# EAGLE design msp430g2553in20-test-board (EAGLE 6.4)
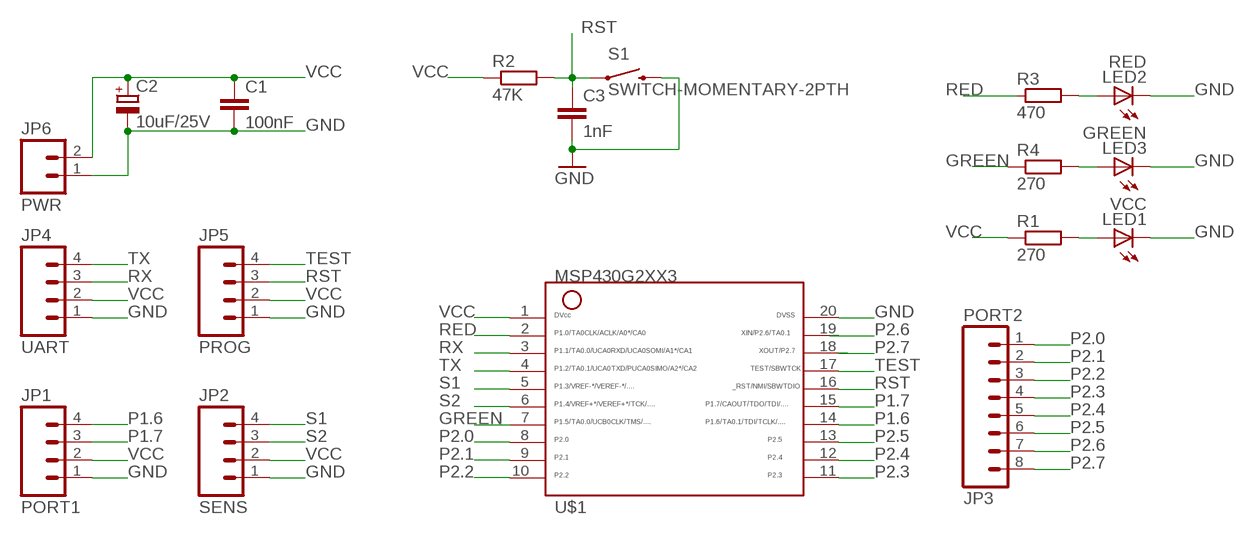
[diagram p0: schematic, sheet 1]

## Parts
C1  100nF  C-EU025-025X050  [C025-025X050]
C2  10uF/25V  CPOL-EUE2-5  [E2-5]
C3  1nF  C-EU025-025X050  [C025-025X050]
JP1  PORT1  M04PTH  [1X04]
JP2  SENS  M04PTH  [1X04]
JP3  PORT2  M081X08  [1X08]
JP4  UART  M04PTH  [1X04]
JP5  PROG  M04PTH  [1X04]
JP6  PWR  M02POLAR  [MOLEX-1X2]
LED1  VCC  LED3MM  [LED3MM]
LED2  RED  LED3MM  [LED3MM]
LED3  GREEN  LED3MM  [LED3MM]
R1  270  R-EU_0204/5  [0204/5]
R2  47K  R-EU_0204/5  [0204/5]
R3  470  R-EU_0204/5  [0204/5]
R4  270  R-EU_0204/5  [0204/5]
S1  SWITCH-MOMENTARY-2PTH  [TACTILE-PTH]
U$1  G2XX3---N20  [N20]

## Nets
GND: C1.2 C2.- C3.2 JP1.1 JP2.1 JP4.1 JP5.1 JP6.1 LED1.K(C) LED2.K(C) LED3.K(C) S1.3 U$1.20
GREEN: R4.1 U$1.7
N$1: LED3.A R4.2
N$4: LED1.A R1.2
N$5: LED2.A R3.2
P1.6: JP1.4 U$1.14
P1.7: JP1.3 U$1.15
P2.0: JP3.1 U$1.8
P2.1: JP3.2 U$1.9
P2.2: JP3.3 U$1.10
P2.3: JP3.4 U$1.11
P2.4: JP3.5 U$1.12
P2.5: JP3.6 U$1.13
P2.6: JP3.7 U$1.19
P2.7: JP3.8 U$1.18
RED: R3.1 U$1.2
RST: C3.1 JP5.3 R2.2 S1.1 U$1.16
RX: JP4.3 U$1.3
S1: JP2.4 U$1.5
S2: JP2.3 U$1.6
TEST: JP5.4 U$1.17
TX: JP4.4 U$1.4
VCC: C1.1 C2.+ JP1.2 JP2.2 JP4.2 JP5.2 JP6.2 R1.1 R2.1 U$1.1

## Library data of the parts
C1 C3 = rcl:C-EU: CAPACITOR, European symbol
C2 = rcl:CPOL-EU: POLARIZED CAPACITOR, European symbol
JP1 JP2 JP4 JP5 = SparkFun-Connectors:M04: Header 4 Standard 4-pin 0.1" header. Use with straight break away headers (SKU : PRT-00116), right angle break away headers (PRT-00553), swiss pins (PRT-00743), machine pins (PRT-00117), and female headers (PRT-00115). Molex polarized connector foot print use with SKU : PRT-08231 with associated crimp pins and housings. 1MM SMD Version SKU: PRT-10208
JP3 = SparkFun-Connectors:M08: Header 8 Standard 8-pin 0.1" header. Use with straight break away headers (SKU : PRT-00116), right angle break away headers (PRT-00553), swiss pins (PRT-00743), machine pins (PRT-00117), and female headers (PRT-00115).
JP6 = SparkFun-Connectors:M02: Header 2 Standard 2-pin 0.1" header. Use with straight break away headers (SKU : PRT-00116), right angle break away headers (PRT-00553), swiss pins (PRT-00743), machine pins (PRT-00117), and female headers (PRT-00115). Molex polarized connector foot print use with SKU : PRT-08233 with associated crimp pins and housings.
LED1-LED3 = led:LED: LED OSRAM: - CHIPLED LG R971, LG N971, LY N971, LG Q971, LY Q971, LO R971, LY R971 LH N974, LH R974 LS Q976, LO Q976, LY Q976 LO Q996 - Hyper CHIPLED LW Q18S LB Q993, LB Q99A, LB R99A - SideLED LS A670, LO A670, LY A670, LG A670, LP A670 LB A673, LV A673, LT A673, LW A673 LH A674 LY A675 LS A676, LA A676, LO A676, LY A676, LW A676 LS A679, LY A679, LG A679 - Hyper Micro SIDELED® LS Y876, LA Y876, LO Y876, LY Y876 LT Y87S - SmartLED LW L88C, LW L88S LB L89C, LB L89S, LG L890 LS L89K, LO L89K, LY L89K LS L896, LA L896, LO L896, LY L896 - TOPLED LS T670, LO T670, LY T670, LG T670, LP T670 LSG T670, LSP T670, LSY T670, LOP T670, LYG T670 LG T671, LOG T671, LSG T671 LB T673, LV T673, LT T673, LW T673 LH T674 LS T676, LA T676, LO T676, LY T676, LB T676, LH T676, LSB T676, LW T676 LB T67C, LV T67C, LT T67C, LS T67K, LO T67K, LY T67K, LW E67C LS E67B, LA E67B, LO E67B, LY E67B, LB E67C, LV E67C, LT E67C LW T67C LS T679, LY T679, LG T679 LS T770, LO T770, LY T770, LG T770, LP T770 LB T773, LV T773, LT T773, LW T773 LH T774 LS E675, LA E675, LY E675, LS T675 LS T776, LA T776, LO T776, LY T776, LB T776 LHGB T686 LT T68C, LB T68C - Hyper Mini TOPLED® LB M676 - Mini TOPLED Santana® LG M470 LS M47K, LO M47K, LY M47K Source: http://www.osram.convergy.de LUXEON: - LUMILED® LXK2-PW12-R00, LXK2-PW12-S00, LXK2-PW14-U00, LXK2-PW14-V00 LXK2-PM12-R00, LXK2-PM12-S00, LXK2-PM14-U00 LXK2-PE12-Q00, LXK2-PE12-R00, LXK2-PE12-S00, LXK2-PE14-T00, LXK2-PE14-U00 LXK2-PB12-K00, LXK2-PB12-L00, LXK2-PB12-M00, LXK2-PB14-N00, LXK2-PB14-P00, LXK2-PB14-Q00 LXK2-PR12-L00, LXK2-PR12-M00, LXK2-PR14-Q00, LXK2-PR14-R00 LXK2-PD12-Q00, LXK2-PD12-R00, LXK2-PD12-S00 LXK2-PH12-R00, LXK2-PH12-S00 LXK2-PL12-P00, LXK2-PL12-Q00, LXK2-PL12-R00 Source: www.luxeon.com KINGBRIGHT: KA-3528ASYC Source: www.kingbright.com
R1-R4 = rcl:R-EU_: RESISTOR, European symbol
S1 = SparkFun-Electromechanical:SWITCH-MOMENTARY-2: Various NO switches- pushbuttons, reed, etc
U$1 = TI_MSP430_v16:G2XX3---N20: MSP430G2XX1 PDIP (N) 20 Pin Package

## Board
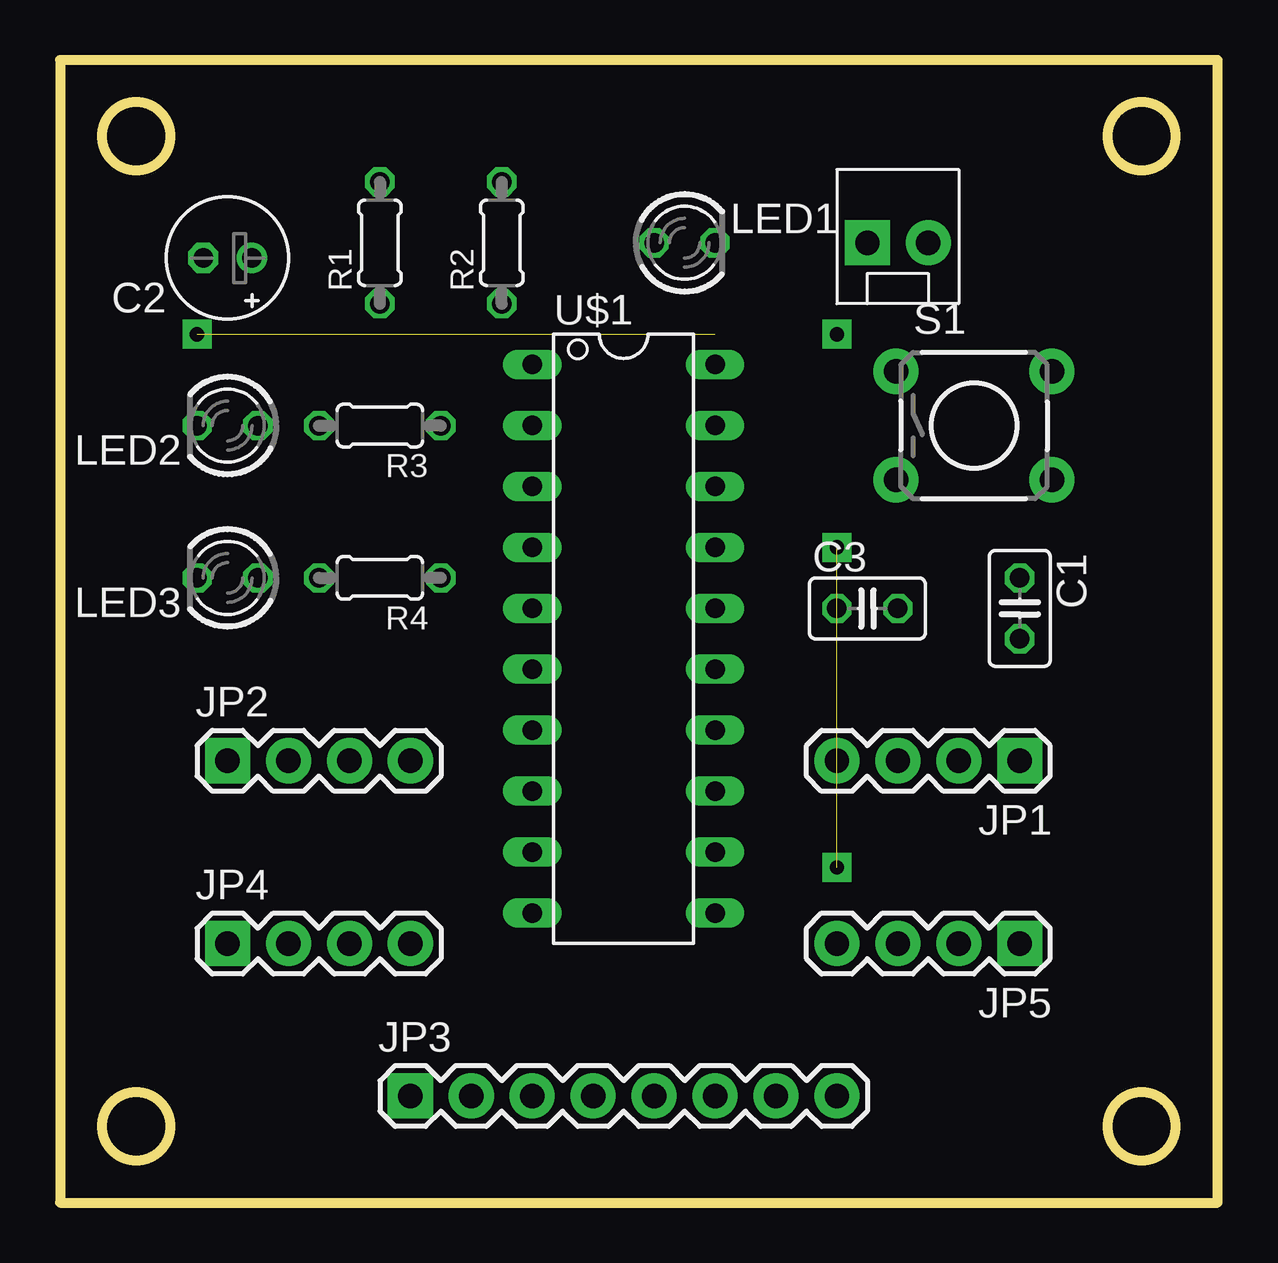
[diagram p1: board, top side]
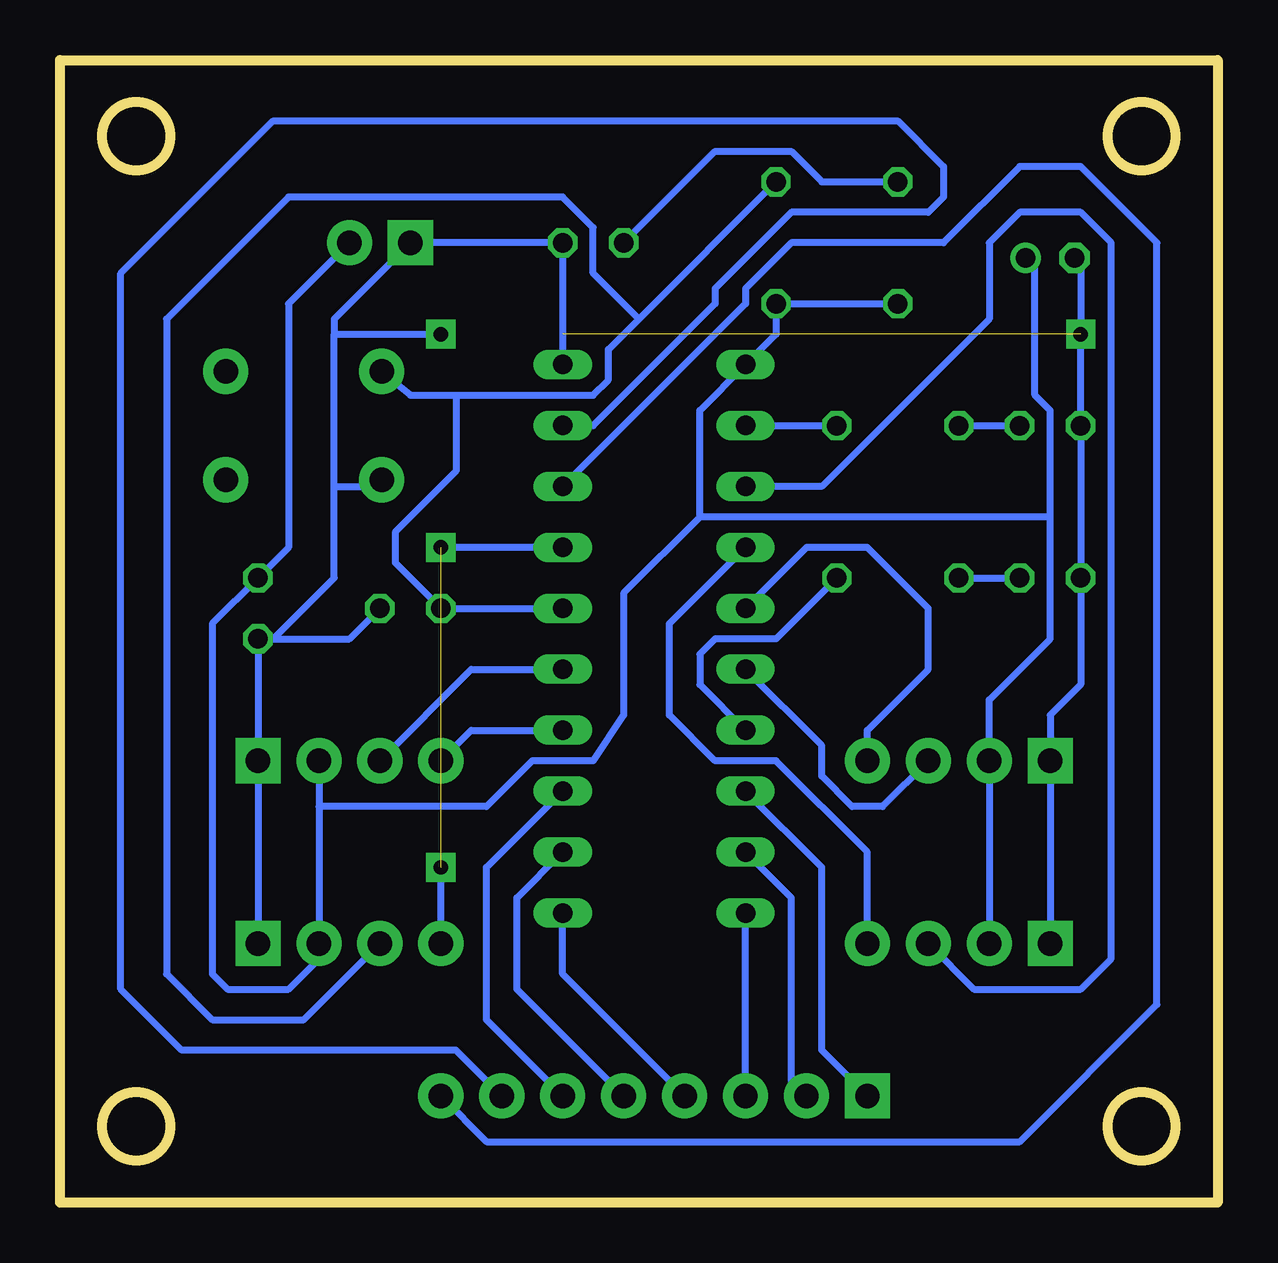
[diagram p2: board, bottom side, seen from below]

Size 48.26 x 47.62 mm. Coordinates in mm from the lower left corner, seen from the top.
Outline: 0,47.62 0,0 48.26,0 48.26,47.62 0,47.62
Outline: circle at 3.18,3.18 radius 1.42
Outline: circle at 45.09,3.18 radius 1.42
Outline: circle at 45.09,44.45 radius 1.42
Outline: circle at 3.18,44.45 radius 1.42
Copper layers (1*16): Top 0.035mm / dielectric 1.5mm / Bottom 0.035mm
Design rules "default-1": minimum track width 0.3mm, minimum drill 0.7mm, track to track 0.4mm, track to pad 0.4mm, pad to pad 0.4mm, via to via 12mil, smd to smd 8mil, copper to edge 0mil, drill to drill 0.8mm, minimum pad ring 0.2mm, minimum via ring 12mil, stop-mask expansion 4mil, vias tented up to drill 0mil, thermal gap 0.8mm

### Footprints (pad centres in the part's own frame; a part is rotated, then mirrored left to right if it is on the bottom)
C025-025X050 = drill 0.813 octagon: 1 -1.27,0; 2 1.27,0
E2-5 = drill 0.813 pad 1.27: + -1.016,0 | drill 0.813 pad 1.27 octagon: - 1.016,0
1X04 = drill 1.016 pad 1.88 square: 1 0,0 | drill 1.016 pad 1.88: 2 2.54,0; 3 5.08,0; 4 7.62,0
1X08 = drill 1.016 pad 1.88 square: 1 0,0 | drill 1.016 pad 1.88: 2 2.54,0; 3 5.08,0; 4 7.62,0; 5 10.16,0; 6 12.7,0; 7 15.24,0; 8 17.78,0
MOLEX-1X2 = drill 1.016 pad 1.88 square: 1 0,0 | drill 1.016 pad 1.88: 2 2.54,0
LED3MM = drill 0.813 octagon: A -1.27,0; K 1.27,0
0204/5 = drill 0.813 octagon: 1 -2.54,0; 2 2.54,0
TACTILE-PTH = drill 1.016 pad 1.88: 1 -3.251,2.261; 2 3.251,2.261; 3 -3.251,-2.261; 4 3.251,-2.261
N20 = drill 0.813 long: 1 -11.435,-3.81; 2 -8.895,-3.81; 3 -6.355,-3.81; 4 -3.815,-3.81; 5 -1.275,-3.81; 6 1.265,-3.81; 7 3.805,-3.81; 8 6.345,-3.81; 9 8.885,-3.81; 10 11.425,-3.81; 11 11.425,3.81; 12 8.885,3.81; 13 6.345,3.81; 14 3.805,3.81; 15 1.265,3.81; 16 -1.275,3.81; 17 -3.815,3.81; 18 -6.355,3.81; 19 -8.895,3.81; 20 -11.435,3.81

### Placement (x,y rotation side)
C1  40,24.77 270 top
C2  6.99,39.37 180 top
C3  33.66,24.77 0 top
JP1  40,18.41 180 top
JP2  6.99,18.41 0 top
JP3  14.6,4.45 0 top
JP4  6.99,10.8 0 top
JP5  40,10.8 180 top
JP6  33.66,40 0 top
LED1  26.03,40 0 top
LED2  6.99,32.39 180 top
LED3  6.99,26.04 180 top
R1  13.33,40 90 top
R2  18.41,40 90 top
R3  13.33,32.39 180 top
R4  13.33,26.04 180 top
S1  38.1,32.39 0 top
U$1  23.49,23.5 270 top

### Tracks (layer width: path | path; a pad name or v marks a point on that pad's centre or on a via)
GND  (via drill 0.6)  (1 unrouted)
  Bottom 0.3: U$1.20 LED1.K JP6.1 36.83,36.83 36.83,36.19 | JP5.1 JP1.1 C1.2 39.37,23.5 | 39.37,23.5 36.2,23.5 C3.2 | 39.37,23.5 36.83,26.04 36.83,29.85 | 36.83,29.85 35.56,29.85 S1.3 | 36.83,29.85 36.83,36.19 | JP4.1 JP2.1 6.99,20.32 5.72,21.59 LED3.K LED2.K v5.72,36.19 5.72,39.37 C2.- | 36.83,36.19 32.38,36.19
GREEN
  Bottom 0.3: R4.1 18.41,23.5 20.95,23.5 21.59,22.86 21.59,21.59 U$1.7
N$1
  Bottom 0.3: R4.2 LED3.A
N$2  (via drill 0.6)
  other vias: 32.38,36.19
N$3  (via drill 0.6)
  other vias: 32.38,27.31
N$4
  Bottom 0.3: R1.2 16.51,42.55 17.78,43.81 20.95,43.81 LED1.A
N$5
  Bottom 0.3: R3.2 LED2.A
N$6  (via drill 0.6)
  other vias: 32.38,13.97
P1.6
  Bottom 0.3: JP1.4 31.11,19.68 U$1.14
P1.7
  Bottom 0.3: JP1.3 31.11,22.23 U$1.15
P2.0
  Bottom 0.3: JP3.1 16.51,6.35 16.51,13.97 U$1.8
P2.1
  Bottom 0.3: JP3.2 17.78,5.08 17.78,12.7 U$1.9
P2.2
  Bottom 0.3: JP3.3 U$1.10
P2.3
  Bottom 0.3: U$1.11 27.3,9.53 JP3.4
P2.4
  Bottom 0.3: JP3.5 29.21,8.89 29.21,12.7 U$1.12
P2.5
  Bottom 0.3: JP3.6 30.48,7.62 30.48,13.97 U$1.13
P2.6
  Bottom 0.3: JP3.7 31.75,6.35 43.18,6.35 45.72,8.89 45.72,38.73 39.37,45.08 13.33,45.08 11.43,43.18 11.43,41.91 12.06,41.28 17.78,41.28 20.95,38.1 20.95,37.47 26.03,32.39 U$1.19
P2.7
  Bottom 0.3: JP3.8 30.48,2.54 8.26,2.54 2.54,8.26 2.54,40 5.72,43.18 8.26,43.18 11.43,40 17.78,40 19.69,38.1 19.69,37.47 U$1.18
RED
  Bottom 0.3: R3.1 U$1.2
RST
  Bottom 0.3: U$1.16 C3.1 34.29,26.67 34.29,27.94 31.75,30.48 31.75,33.66 | 24.13,36.83 25.4,35.56 25.4,34.29 26.03,33.66 31.75,33.66 | 24.13,36.83 R2.2 | 31.75,33.66 33.66,33.66 S1.1 | JP5.3 38.1,7.62 41.91,7.62 43.81,9.53 43.81,36.83 38.73,41.91 27.3,41.91 26.03,40.64 26.03,38.73 24.13,36.83
RX
  Bottom 0.3: JP4.3 10.16,8.89 5.72,8.89 4.45,10.16 4.45,40 5.72,41.28 8.26,41.28 9.53,40 9.53,36.83 16.51,29.85 U$1.3
S1
  Bottom 0.3: JP2.4 14.6,19.68 12.06,22.23 12.06,24.77 14.6,27.31 17.15,27.31 U$1.5
S2
  Bottom 0.3: JP2.3 13.97,16.51 15.24,16.51 16.51,17.78 16.51,19.05 U$1.6
TEST  (1 unrouted)
  Bottom 0.3: U$1.17 29.21,27.31 32.38,27.31 | JP5.4 32.38,13.97
TX
  Bottom 0.3: JP4.4 14.6,14.61 18.41,18.41 20.95,18.41 22.86,20.32 22.86,24.13 U$1.4
VCC
  Bottom 0.3: JP1.2 37.46,16.51 | 37.46,16.51 JP5.2 37.46,10.16 38.73,8.89 41.27,8.89 41.91,9.53 41.91,24.13 C1.1 38.73,27.31 38.73,37.47 JP6.2 | R1.1 R2.1 18.41,36.19 U$1.1 | 6.99,28.57 6.99,23.5 9.53,20.96 JP2.2 JP4.2 | 6.99,28.57 6.99,33.02 7.62,33.66 7.62,39.37 C2.+ | U$1.1 21.59,33.02 21.59,28.57 | 6.99,28.57 21.59,28.57 | U$1.1 | 37.46,16.51 30.48,16.51 28.57,18.41 26.03,18.41 24.77,20.32 24.77,25.4 21.59,28.57